# EAGLE schematic paka (EAGLE 7.5.0)
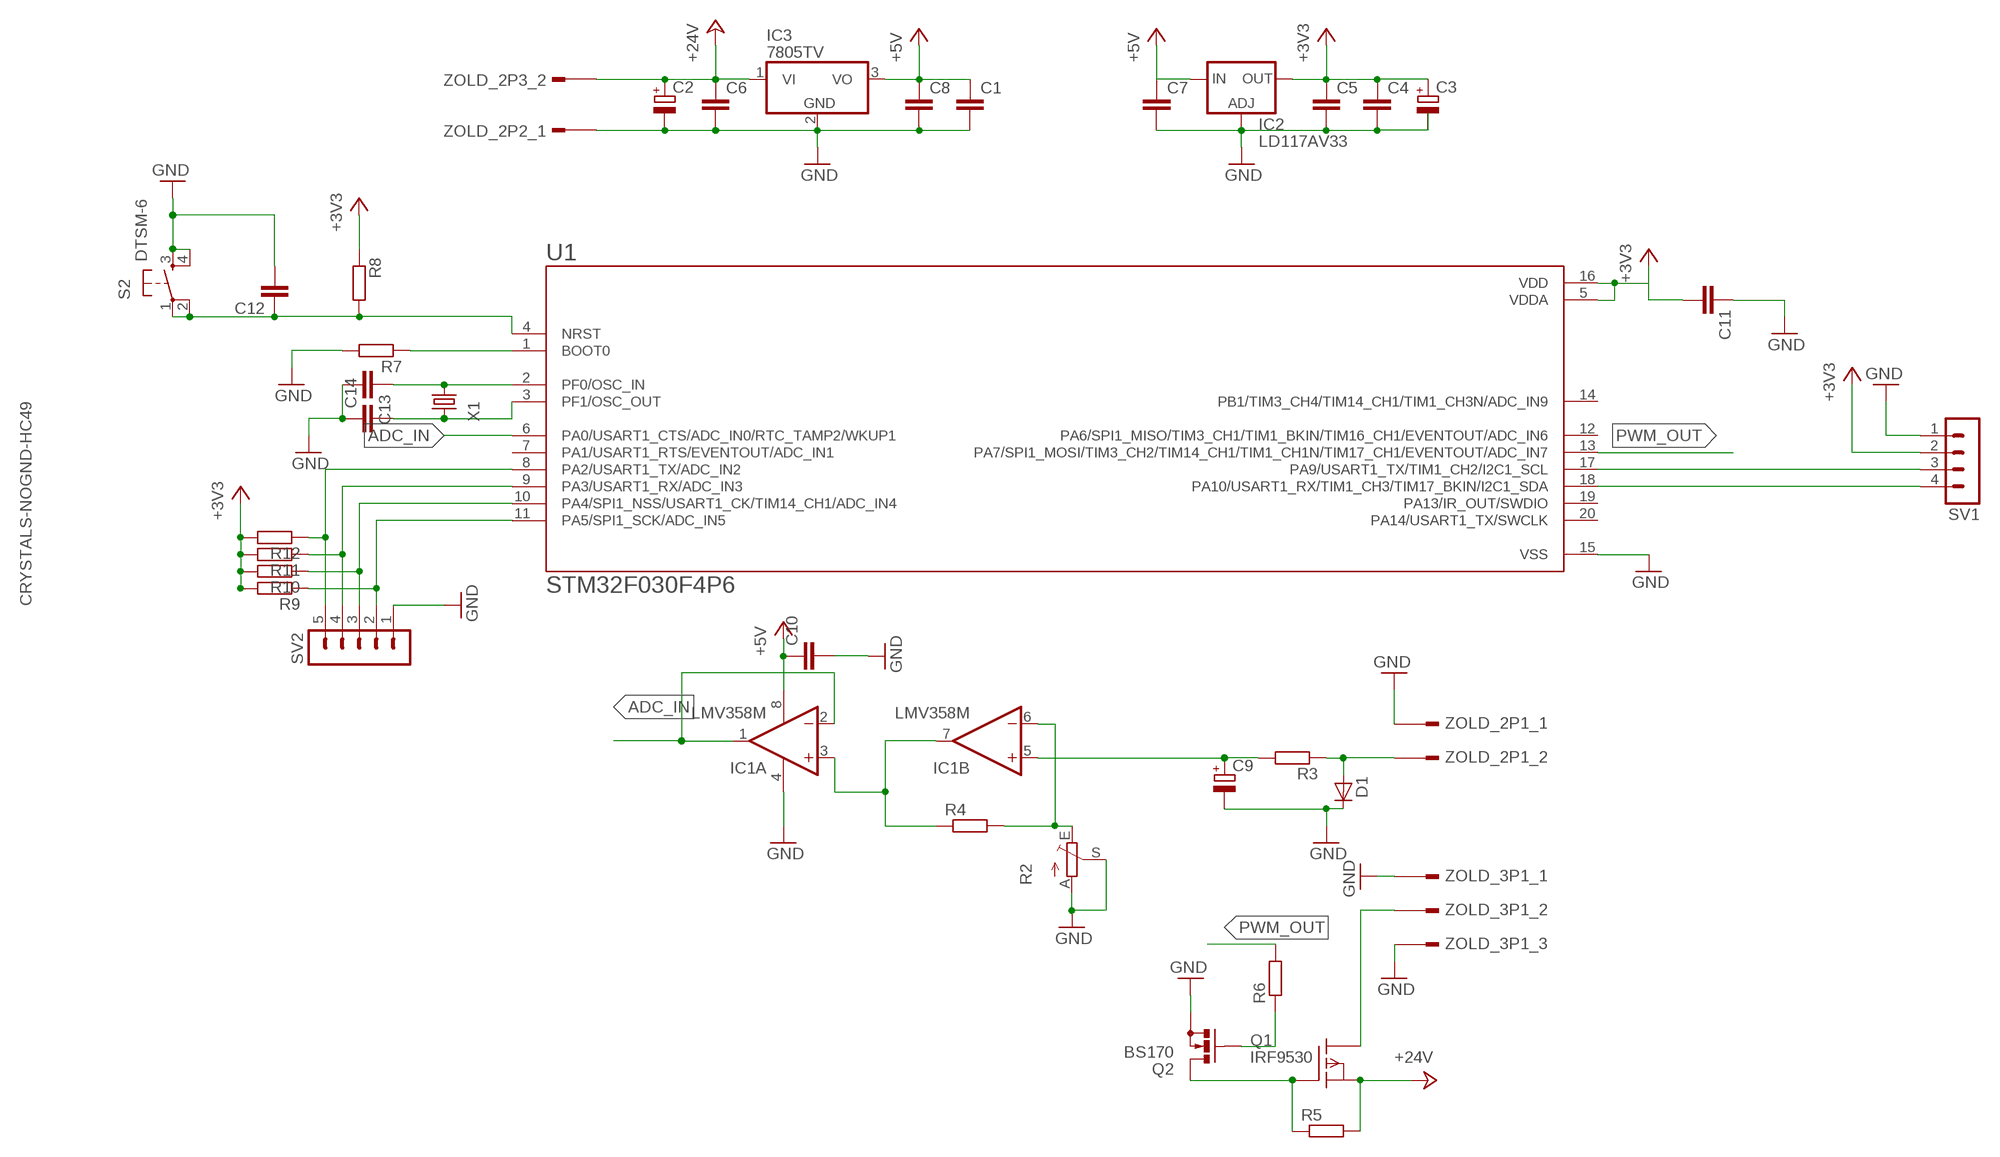
[diagram p0: schematic, sheet 1]

## Parts
C1  C-EUC0805  [C0805]
C2  CPOL-EUE3.5-8  [E3,5-8]
C3  CPOL-EUE2.5-6  [E2,5-6]
C4  C-EUC0805  [C0805]
C5  C-EUC0805  [C0805]
C6  C-EUC0805  [C0805]
C7  C-EUC0805  [C0805]
C8  C-EUC0805  [C0805]
C9  CPOL-EUE2.5-6  [E2,5-6]
C10  C-EUC0805  [C0805]
C11  C-EUC0805  [C0805]
C12  C-EUC0805  [C0805]
C13  C-EUC0805  [C0805]
C14  C-EUC0805  [C0805]
D1  D0805  [D0805]
IC1  LMV358M  [SO08]
IC2  LD117AV33  [TO220L1]
IC3  7805TV  [TO220V]
Q1  IRF9530  [TO220]
Q2  BS170  [SOT54E]
R2  TRIM_EU-PT10  [PT-10]
R3  R-EU_R0805  [R0805]
R4  R-EU_R0805  [R0805]
R5  R-EU_R0805  [R0805]
R6  R-EU_R0805  [R0805]
R7  R-EU_R0805  [R0805]
R8  R-EU_R0805  [R0805]
R9  R-EU_R0805  [R0805]
R10  R-EU_R0805  [R0805]
R11  R-EU_R0805  [R0805]
R12  R-EU_R0805  [R0805]
S2  DTSM-6  [DTSM-6]
SV1  MA04-1  [MA04-1]
SV2  MA05-1  [MA05-1]
U1  STM32F030F4P6  [SOP65P640X120-20N]
X1  CRYSTALS-NOGND-HC49  [HC49]
ZOLD_2P1  ZOLD_KICSI_2PFEKVO  [ZOLD_KICSI_2P_FEKVO]
ZOLD_2P2  ZOLD_KICSI_2PFEKVO  [ZOLD_KICSI_2P_FEKVO]
ZOLD_2P3  ZOLD_KICSI_2PFEKVO  [ZOLD_KICSI_2P_FEKVO]
ZOLD_3P1  ZOLD_KICSI_3PFEKVŐ  [ZOLD_KICSI_3P_FEKVO]

## Nets
+3V3: C3.+ C4.1 C5.1 C11.2 IC2.2(OUT) R8.1 R9.2 R10.2 R11.2 R12.2 SV1.2 U1.5(VDDA) U1.16(VDD)
+5V: C1.1 C7.1 C8.1 C10.1 IC1.8(P:V+) IC2.3(IN) IC3.3(VO)
+24V: C2.+ C6.1 IC3.1(VI) Q1.3(S) R5.2 ZOLD_2P3.2
ADC_IN: IC1.1(A:OUT) IC1.2(A:-IN) U1.6(PA0/USART1_CTS/ADC_IN0/RTC_TAMP2/WKUP1)
GND: C1.2 C2.- C4.2 C5.2 C6.2 C7.2 C8.2 C9.- C10.2 C11.1 C12.2 C13.2 C14.1 D1.2(C) IC1.4(P:V-) IC2.1(ADJ) IC3.2(GND) Q2.S R2.A R2.S R7.2 S2.3 S2.4 SV1.1 SV2.1 U1.15(VSS) ZOLD_2P1.1 ZOLD_2P2.1 ZOLD_3P1.1 ZOLD_3P1.3
N$1: D1.1(A) R3.1 ZOLD_2P1.2
N$2: C9.+ IC1.5(B:+IN) R3.2
N$3: IC1.6(B:-IN) R2.E R4.2
N$4: Q1.2(D) ZOLD_3P1.2
N$5: IC1.3(A:+IN) IC1.7(B:OUT) R4.1
N$6: Q1.1(G) Q2.D R5.1
N$7: Q2.G R6.1
N$8: R9.1 SV2.2 U1.11(PA5/SPI1_SCK/ADC_IN5)
N$9: R7.1 U1.1(BOOT0)
N$10: C12.1 R8.2 S2.1 S2.2 U1.4(NRST)
N$11: R10.1 SV2.3 U1.10(PA4/SPI1_NSS/USART1_CK/TIM14_CH1/ADC_IN4)
N$12: R11.1 SV2.4 U1.9(PA3/USART1_RX/ADC_IN3)
N$13: C13.1 U1.2(PF0/OSC_IN) X1.1
N$14: C14.2 U1.3(PF1/OSC_OUT) X1.2
N$15: R12.1 SV2.5 U1.8(PA2/USART1_TX/ADC_IN2)
N$17: SV1.3 U1.17(PA9/USART1_TX/TIM1_CH2/I2C1_SCL)
N$18: SV1.4 U1.18(PA10/USART1_RX/TIM1_CH3/TIM17_BKIN/I2C1_SDA)
PWM_OUT: R6.2 U1.13(PA7/SPI1_MOSI/TIM3_CH2/TIM14_CH1/TIM1_CH1N/TIM17_CH1/EVENTOUT/ADC_IN7)
Unconnected: C3.- U1.7(PA1/USART1_RTS/EVENTOUT/ADC_IN1) U1.12(PA6/SPI1_MISO/TIM3_CH1/TIM1_BKIN/TIM16_CH1/EVENTOUT/ADC_IN6) U1.14(PB1/TIM3_CH4/TIM14_CH1/TIM1_CH3N/ADC_IN9) U1.19(PA13/IR_OUT/SWDIO) U1.20(PA14/USART1_TX/SWCLK) ZOLD_2P2.2 ZOLD_2P3.1

## Library data of the parts
C1 C4-C8 C10-C14 = rcl:C-EU: CAPACITOR, European symbol
C2 C3 C9 = rcl:CPOL-EU: POLARIZED CAPACITOR, European symbol
D1 = Cf_Felv:D
IC1 = linear:LMV358?*: Dual General Purpose, Low Voltage, Rail-to-Rail Output Operational Amplifiers Source: http://www.national.com/mpf/LM/LMV321.html http://www.national.com/dt/lmv_qual.pdf
IC2 = v-reg:LD117A?*: Low drop fixed and adjustable positive voltage regulators 1 A Source: http://www.st.com/stonline/products/literature/ds/7194/ld1117axx.pdf
IC3 = linear:78*: Positive VOLTAGE REGULATOR Source: http://cache.national.com/ds/LM/LM78L05.pdf http://www.fairchildsemi.com/ds/LM/LM7805.pdf
Q1 = transistor-fet:IRF9530: P-Channel Enhancement MOSFET (HEXFET); -100V; -12A; 0,3Ohm
Q2 = transistor-small-signal:BS170: N-CHANNEL MOS FET
R2 = pot:TRIM_EU-: POTENTIOMETER
R3-R12 = rcl:R-EU_: RESISTOR, European symbol
S2 = switch-tact:DTSM-6
SV1 = con-lstb:MA04-1: PIN HEADER; OC_FARNELL: unknown; OC_NEWARK: unknown
SV2 = con-lstb:MA05-1: PIN HEADER; OC_FARNELL: unknown; OC_NEWARK: unknown
U1 = STM32F030F4P6:STM32F030F4P6: MCU 32-bit STM32F ARM Cortex M0 RISC 16KB Flash 2.5V/3.3V 20-Pin TSSOP Tray Check prices <https://pricing.snapeda.com/search/part/STM32F030F4P6/?ref=eda>; AVAILABILITY: Good; DESCRIPTION: ARM® Cortex®-M0 STM32F0 Microcontroller IC 32-Bit 48MHz 16KB (16K x 8) FLASH 20-TSSOP; MF: STMicroelectronics; MP: STM32F030F4P6; PACKAGE: TSSOP-20 STMicroelectronics; PRICE: None; PURCHASE-URL: https://pricing.snapeda.com/search/part/STM32F030F4P6/?ref=eda
X1 = IQD-Frequency-Products:CRYSTALS-NOGND: CRYSTALS CAN NOT GROUNDED
ZOLD_2P1-ZOLD_2P3 = narval:ZOLD_KICSI_2P
ZOLD_3P1 = narval:ZOLD_KICSI_3P